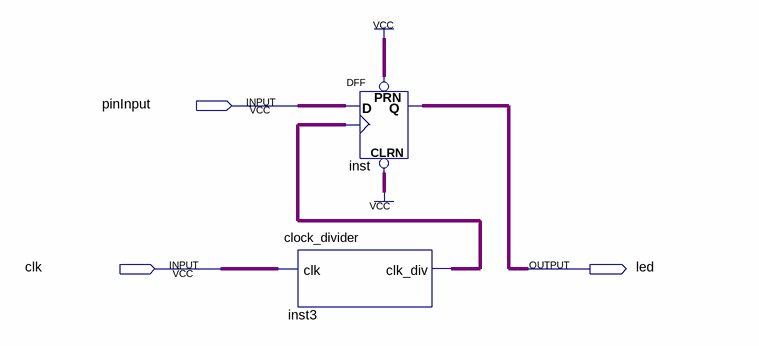
[diagram p0: schematic sheet]
// Quartus schematic Led_blinking_wButton.bdf as structural Verilog: 2 symbols, 3 pins
module Led_blinking_wButton (
  input  pinInput,
  input  clk,
  output led
);

  wire inst3_clk_div;

  clock_divider inst3 (.clk(clk), .clk_div(inst3_clk_div));
  DFF inst (.CLRN(1'b1), .CLK(inst3_clk_div), .D(pinInput), .PRN(1'b1), .Q(led));
endmodule
